# Altium schematic sheet BNO055.SchDoc
size A; SheetNumber: 4; SheetTotal: 4
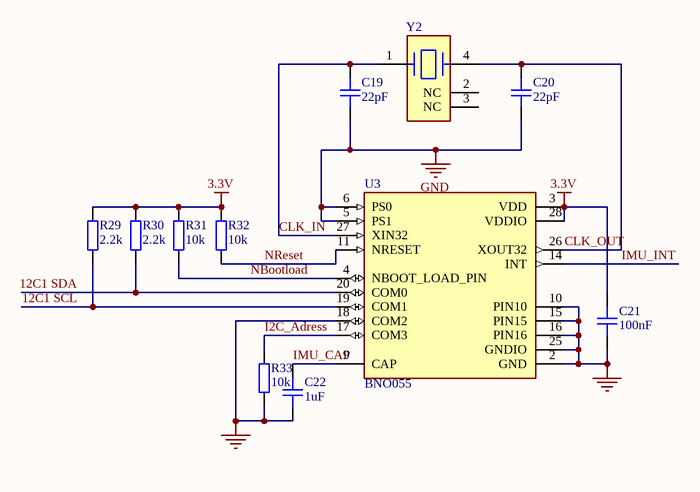
[diagram p0: BNO055.SchDoc]

## Parts
C19  22pF  [CAP_0603]
C20  22pF  [CAP_0603]
C21  100nF  [CAP_0603]
C22  1uF  [CAP_0603]
R29  2.2k  [RES_0603]
R30  2.2k  [RES_0603]
R31  10k  [RES_0603]
R32  10k  [RES_0603]
R33  10k  [RES_0603]
U3  BNO055  [LGA28R50P4X10_380X520X100]
Y2  ABS25-32.768KHZ-T  [FP-ABS25-MFG]  (value not drawn)

## Nets
3.3V: C21.2 R29.1 R30.1 R31.1 R32.1 U3.3(VDD) U3.28(VDDIO)
GND: C19.1 C20.1 C21.1 C22.1 R33.2 U3.2(GND) U3.5(PS1) U3.6(PS0) U3.10(PIN10) U3.15(PIN15) U3.16(PIN16) U3.18(COM2) U3.25(GNDIO)
12C1 SCL: R29.2 U3.19(COM1)
12C1 SDA: R30.2 U3.20(COM0)
CLK_IN: C19.2 U3.27(XIN32) Y2.1
CLK_OUT: C20.2 U3.26(XOUT32) Y2.4
I2C_Adress: R33.1 U3.17(COM3)
IMU_CAP: C22.2 U3.9(CAP)
IMU_INT: U3.14(INT)
NBootload: R31.2 U3.4(NBOOT_LOAD_PIN)
NReset: R32.2 U3.11(NRESET)

Not connected (* = marked no-connect by the designer): Y2 2(NC) 3(NC)

## Library data of the parts
C19-C22 = CAP_0603: Capacitor SMD 0603; Manufacturer: *; Manufacturer Part Number: *; Distributor Link: *; LCSC: *; Rating: *; Dielectric: *
R29-R33 = RES_0603: Resistor SMD 0603; Manufacturer: *; Manufacturer Part Number: *; Distributor Link: *; LCSC: *
U3 = BNO055: BNO055 9-axis Absolute Orientation Sensor ( SiP ) w/Sensors and Sensor Fusion; Package: None; Price: None; Value: *; MP: BNO055; Availability: Unavailable
Y2 = CMP-2000-05037-2: CRYSTAL 32.7680KHZ 12.5PF SMD; ESR (Equivalent Series Resistance): 50kR; Tolerance: 20ppm; Width: 3.8mm; REACH SVHC: No SVHC; Load Capacitance: 12.5pF; Case/Package: SMD/SMT; Radiation Hardening: No; Series: ABS25; Number of Pins: 4; Mount: Surface Mount; RoHS Compliant: Yes; Packaging: Tape and Reel; Termination: SMD/SMT; Frequency Tolerance: 20ppm; Lead Free: Lead Free; Package Quantity: 1000; Min Operating Temperature: -40°C; Height: 0.098inch; Length: 8mm; Frequency: 32.768kHz; Max Operating Temperature: 85°C; Series Resistance: 50kR; Operating Frequency: 32.768 kHz; Depth: 3.8mm